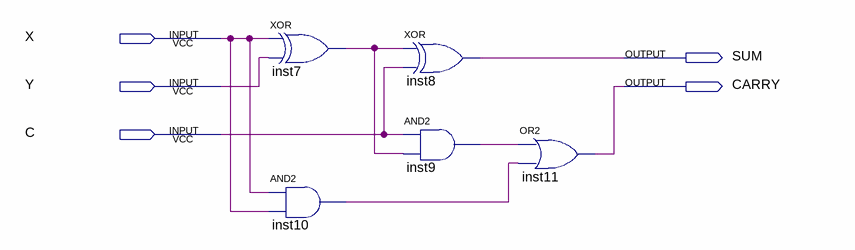
[diagram p0: schematic sheet]
// Quartus schematic FullAdder.bdf as structural Verilog: 5 symbols, 5 pins
module FullAdder (
  input  X,
  input  Y,
  input  C,
  output SUM,
  output CARRY
);

  wire inst7_out, inst9_out, inst10_out;

  xor inst7 (inst7_out, X, Y);
  and inst10 (inst10_out, X, X);
  xor inst8 (SUM, inst7_out, C);
  and inst9 (inst9_out, C, inst7_out);
  or inst11 (CARRY, inst9_out, inst10_out);
endmodule
